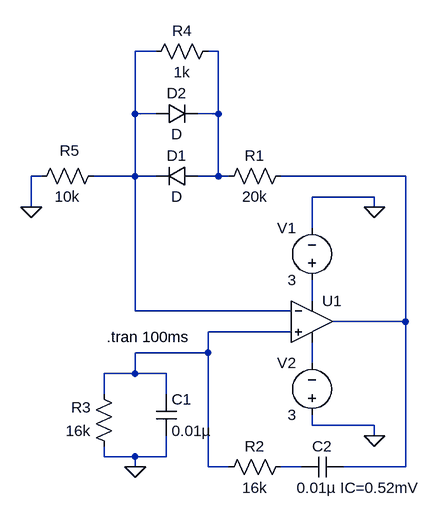
[diagram p0: schematic 5-4.asc]
5-4.asc, the LTspice schematic file:
Version 4
SHEET 1 880 680
WIRE 0 -256 -32 -256
WIRE 96 -256 80 -256
WIRE -32 -160 -32 -256
WIRE 0 -160 -32 -160
WIRE 96 -160 96 -256
WIRE 96 -160 64 -160
WIRE -176 -64 -192 -64
WIRE -32 -64 -32 -160
WIRE -32 -64 -96 -64
WIRE 0 -64 -32 -64
WIRE 96 -64 96 -160
WIRE 96 -64 64 -64
WIRE 112 -64 96 -64
WIRE 384 -64 192 -64
WIRE 336 -32 240 -32
WIRE -192 -16 -192 -64
WIRE 336 -16 336 -32
WIRE 240 16 240 -32
WIRE 240 128 240 96
WIRE -32 144 -32 -64
WIRE 208 144 -32 144
WIRE 384 160 384 -64
WIRE 384 160 272 160
WIRE 208 176 80 176
WIRE 80 208 80 176
WIRE 80 208 -32 208
WIRE 240 224 240 192
WIRE -32 240 -32 208
WIRE -32 240 -80 240
WIRE 16 240 -32 240
WIRE -80 272 -80 240
WIRE 16 272 16 240
WIRE 240 320 240 304
WIRE 336 320 240 320
WIRE 336 336 336 320
WIRE -80 368 -80 352
WIRE -32 368 -80 368
WIRE 16 368 16 336
WIRE 16 368 -32 368
WIRE -32 384 -32 368
WIRE 80 384 80 208
WIRE 112 384 80 384
WIRE 224 384 192 384
WIRE 384 384 384 160
WIRE 384 384 288 384
FLAG 336 -16 0
FLAG 336 336 0
FLAG -192 -16 0
FLAG -32 384 0
SYMBOL Opamps\\UniversalOpamp2 240 160 R0
SYMATTR InstName U1
SYMBOL voltage 240 112 R180
WINDOW 0 24 96 Left 2
WINDOW 3 24 16 Left 2
WINDOW 123 0 0 Left 2
WINDOW 39 0 0 Left 2
SYMATTR InstName V1
SYMATTR Value 3
SYMBOL voltage 240 320 R180
WINDOW 0 24 96 Left 2
WINDOW 3 24 16 Left 2
WINDOW 123 0 0 Left 2
WINDOW 39 0 0 Left 2
SYMATTR InstName V2
SYMATTR Value 3
SYMBOL res 208 -80 R90
WINDOW 0 0 56 VBottom 2
WINDOW 3 32 56 VTop 2
SYMATTR InstName R1
SYMATTR Value 20k
SYMBOL res 208 368 R90
WINDOW 0 0 56 VBottom 2
WINDOW 3 32 56 VTop 2
SYMATTR InstName R2
SYMATTR Value 16k
SYMBOL res -64 368 R180
WINDOW 0 36 76 Left 2
WINDOW 3 36 40 Left 2
SYMATTR InstName R3
SYMATTR Value 16k
SYMBOL res -16 -240 R270
WINDOW 0 32 56 VTop 2
WINDOW 3 0 56 VBottom 2
SYMATTR InstName R4
SYMATTR Value 1k
SYMBOL res -192 -48 R270
WINDOW 0 40 59 VTop 2
WINDOW 3 0 56 VBottom 2
SYMATTR InstName R5
SYMATTR Value 10k
SYMBOL diode 64 -80 R90
WINDOW 0 0 32 VBottom 2
WINDOW 3 32 32 VTop 2
SYMATTR InstName D1
SYMBOL diode 0 -144 R270
WINDOW 0 32 32 VTop 2
WINDOW 3 0 32 VBottom 2
SYMATTR InstName D2
SYMBOL cap 0 272 R0
SYMATTR InstName C1
SYMATTR Value 0.01µ
SYMBOL cap 288 368 R90
WINDOW 0 0 32 VBottom 2
WINDOW 3 32 -23 VTop 2
SYMATTR InstName C2
SYMATTR Value 0.01µ IC=0.52mV
TEXT -76 184 Left 2 !.tran 100ms

The netlist it stands for:
* 5-4.asc
XU1 N005 N001 N004 N006 N003 level.2 Avol=1Meg GBW=10Meg Slew=10Meg ilimit=25m rail=0 Vos=0 phimargin=45 en=0 enk=0 in=0 ink=0 Rin=500Meg  ; pins IN+ IN- V+ V- OUT
V1 N004 0 3
V2 0 N006 3
R1 N003 N002 20k
R2 N007 N005 16k
R3 0 N005 16k
R4 N001 N002 1k
R5 0 N001 10k
D1 N002 N001 D
D2 N001 N002 D
C1 N005 0 0.01µ
C2 N003 N007 0.01µ IC=0.52mV
.model D D
.lib standard.dio
.tran 100ms
.lib UniversalOpamps2.sub
.backanno
.end